# EAGLE board E8-F (EAGLE 6.6.0), part 1 of 2
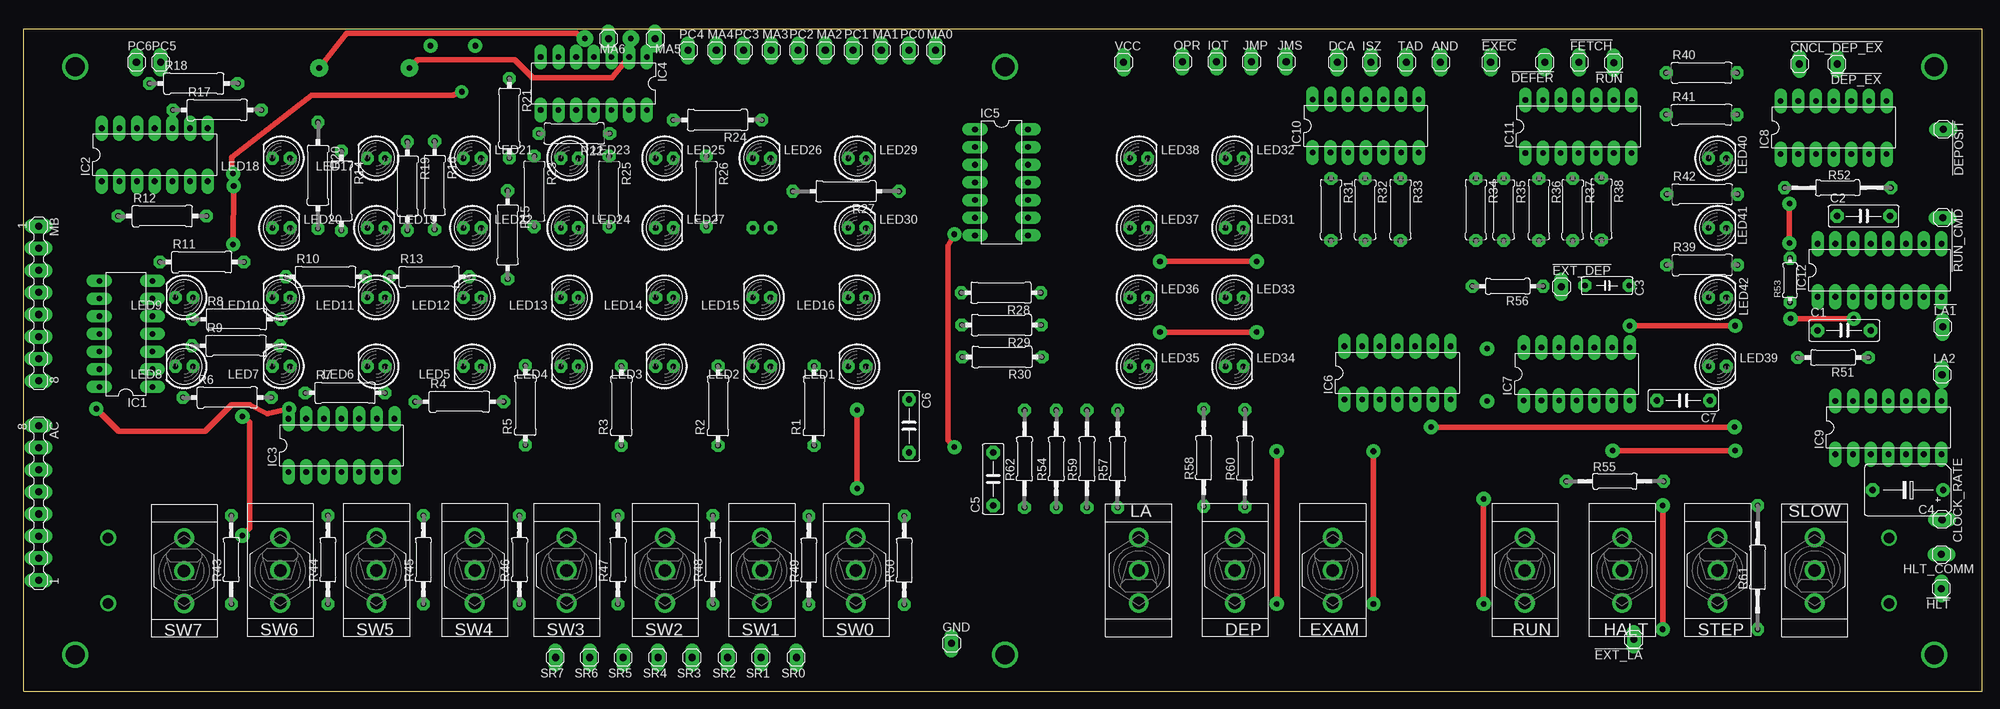
[diagram p2: board, top side]
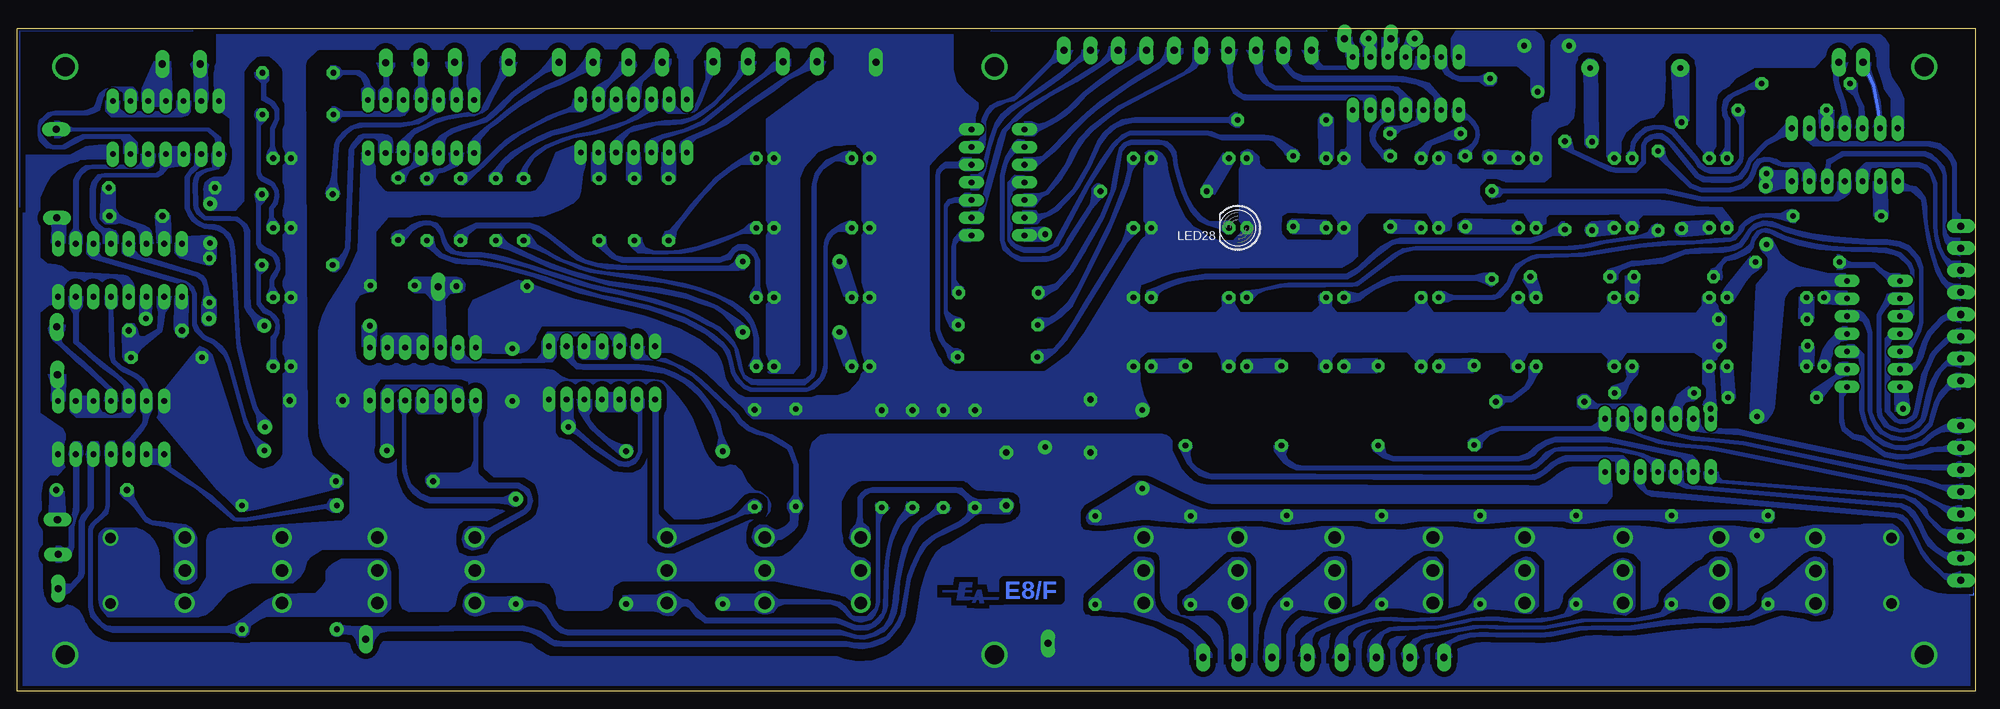
[diagram p3: board, bottom side, seen from below]

Size 281.35 x 95.17 mm. Coordinates in mm from the lower left corner, seen from the top.
Outline: 0,0 281.35,0 281.35,95.17 0,95.17 0,0
Copper layers (1*16): Top 0.035mm / dielectric 1.5mm / Bottom 0.035mm
Design rules "default *": minimum track width 3mil, minimum drill 32mil, track to track 8mil, track to pad 8mil, pad to pad 8mil, via to via 8mil, smd to smd 8mil, copper to edge 10mil, drill to drill 8mil, minimum pad ring 20mil, minimum via ring 8mil, stop-mask expansion 4mil, vias tented up to drill 0mil, thermal gap 10mil

## Footprints (pad centres in the part's own frame; a part is rotated, then mirrored left to right if it is on the bottom)
MA01-1 = drill 1.016 long: 1 0,0
MA08-1 = drill 1.016 long: 1 -12.7,0; 2 -9.525,0; 3 -6.35,0; 4 -3.175,0; 5 0,0; 6 3.175,0; 7 6.35,0; 8 9.525,0
C075-032X103 = drill 0.914 octagon: 1 -3.81,0; 2 3.81,0
C063-025X075 = drill 0.813 octagon: 1 -2.54,0; 2 3.81,0
B45181C = drill 0.914: + -5.08,0 | drill 0.914 octagon: - 5.08,0
7109 = drill 1.803: 1 0,4.699; 2 0,0; 3 0,-4.699
DIL14 = drill 0.813 long: 1 -7.62,-3.81; 2 -5.08,-3.81; 3 -2.54,-3.81; 4 0,-3.81; 5 2.54,-3.81; 6 5.08,-3.81; 7 7.62,-3.81; 8 7.62,3.81; 9 5.08,3.81; 10 2.54,3.81; 11 0,3.81; 12 -2.54,3.81; 13 -5.08,3.81; 14 -7.62,3.81
DIL16 = drill 0.813 long: 1 -8.89,-3.81; 2 -6.35,-3.81; 3 -3.81,-3.81; 4 -1.27,-3.81; 5 1.27,-3.81; 6 3.81,-3.81; 7 6.35,-3.81; 8 8.89,-3.81; 9 8.89,3.81; 10 6.35,3.81; 11 3.81,3.81; 12 1.27,3.81; 13 -1.27,3.81; 14 -3.81,3.81; 15 -6.35,3.81; 16 -8.89,3.81
LED5MM = drill 0.813 octagon: A -1.27,0; K 1.27,0
0309/.45 = drill 0.813 octagon: 1 -5.715,0; 2 5.715,0
0309/12 = drill 0.813 octagon: 1 -6.35,0; 2 6.35,0
0309/11 = drill 0.813 octagon: 1 -6.032,0; 2 6.032,0
0309/15 = drill 0.813 octagon: 1 -7.62,0; 2 7.62,0
0309/10 = drill 0.813 octagon: 1 -5.08,0; 2 5.08,0
0309/8 = drill 0.813 octagon: 1 -4.445,0; 2 4.445,0
0207/12 = drill 0.813 octagon: 1 -6.35,0; 2 6.35,0
0207/10 = drill 0.813 octagon: 1 -5.08,0; 2 5.08,0
0207/15 = drill 0.813 octagon: 1 -7.62,0; 2 7.62,0
0204/6 = drill 0.813 octagon: 1 -3.175,0; 2 3.175,0
0207/13 = drill 0.813 octagon: 1 -6.985,0; 2 6.985,0
0207/22 = drill 0.813 octagon: 1 -8.89,0; 2 8.89,0

## Placement (x,y rotation side)
!CNCL_DEP_EX  MA01-1  [MA01-1]  255.1,90.09 0 top
!DEFER  MA01-1  [MA01-1]  218.52,90.34 180 top
!DEP_EX  MA01-1  [MA01-1]  260.52,90.09 180 top
!DEPOSIT  MA01-1  [MA01-1]  275.76,80.69 270 top
!EXEC  MA01-1  [MA01-1]  210.74,90.34 0 top
!EXT_DEP  MA01-1  [MA01-1]  220.9,58.08 0 top
!EXT_LA  MA01-1  [MA01-1]  231.31,7.45 180 top
!FETCH  MA01-1  [MA01-1]  223.44,90.34 0 top
!HLT  MA01-1  [MA01-1]  275.51,14.73 180 top
!LA1  MA01-1  [MA01-1]  275.67,52.32 0 top
!RUN  MA01-1  [MA01-1]  228.43,90.25 180 top
!RUN_CMD  MA01-1  [MA01-1]  275.67,67.99 270 top
AC  AC  [MA08-1]  2.12,28.62 90 top
AND  MA01-1  [MA01-1]  203.54,90.34 0 top
C1  100pF  [C075-032X103]  261.54,51.82 0 top
C2  1nF  [C075-032X103]  264.33,68.24 0 top
C3  0.1uF  [C063-025X075]  226.82,58.25 0 top
C4  47uF  [B45181C]  270.68,28.87 180 top
C5  0.1uF  [C075-032X103]  139.28,30.48 90 top
C6  0.1uF  [C075-032X103]  127.17,38.1 270 top
C7  0.047uF  [C075-032X103]  238.42,41.74 180 top
CLOCK_RATE  MA01-1  [MA01-1]  275.59,24.64 270 top
DCA  MA01-1  [MA01-1]  188.72,90.34 0 top
DEP  710X  [7109]  173.99,17.36 180 top
EXAM  710X  [7109]  188.04,17.36 180 top
GND  MA01-1  [MA01-1]  133.27,6.86 0 top
HALT  710X  [7109]  229.62,17.36 180 top
HLT_COMM  MA01-1  [MA01-1]  275.51,19.64 90 top
IC1  7405N  [DIL14]  14.65,51.31 90 top
IC2  7405N  [DIL14]  18.8,77.05 0 top
IC3  7405N  [DIL14]  45.64,35.31 0 top
IC4  7405N  [DIL14]  81.87,87.29 180 top
IC5  7405N  [DIL14]  140.46,73.07 270 top
IC6  7400N  [DIL14]  197.36,45.72 0 top
IC7  7400N  [DIL14]  223.1,45.55 0 top
IC8  7400N  [DIL14]  260.01,80.94 0 top
IC9  7400N  [DIL14]  267.89,37.85 0 top
IC10  7417N  [DIL14]  192.79,81.2 0 top
IC11  7417N  [DIL14]  223.35,81.11 0 top
IC12  DM9602N  [DIL16]  266.62,60.45 0 top
IOT  MA01-1  [MA01-1]  171.37,90.42 0 top
ISZ  MA01-1  [MA01-1]  193.55,90.34 0 top
JMP  MA01-1  [MA01-1]  176.36,90.42 0 top
JMS  MA01-1  [MA01-1]  181.36,90.42 0 top
LA  710X  [7109]  160.19,17.36 0 top
LA2  MA01-1  [MA01-1]  275.59,45.47 0 top
LED1  [LED5MM]  119.72,46.65 180 top
LED2  [LED5MM]  106,46.65 180 top
LED3  [LED5MM]  92.03,46.65 180 top
LED4  [LED5MM]  78.4,46.65 180 top
LED5  [LED5MM]  64.43,46.65 180 top
LED6  [LED5MM]  50.63,46.65 180 top
LED7  [LED5MM]  37,46.65 180 top
LED8  [LED5MM]  23.03,46.65 180 top
LED9  [LED5MM]  23.03,56.56 180 top
LED10  [LED5MM]  37,56.56 180 top
LED11  [LED5MM]  50.63,56.56 180 top
LED12  [LED5MM]  64.43,56.56 180 top
LED13  [LED5MM]  78.4,56.56 180 top
LED14  [LED5MM]  92.03,56.56 180 top
LED15  [LED5MM]  106,56.56 180 top
LED16  [LED5MM]  119.72,56.56 180 top
LED17  [LED5MM]  50.63,76.54 180 top
LED18  [LED5MM]  37,76.54 180 top
LED19  [LED5MM]  50.63,66.55 0 top
LED20  [LED5MM]  37,66.55 0 top
LED21  [LED5MM]  64.43,76.54 0 top
LED22  [LED5MM]  64.43,66.55 0 top
LED23  [LED5MM]  78.4,76.54 0 top
LED24  [LED5MM]  78.4,66.55 0 top
LED25  [LED5MM]  92.03,76.54 0 top
LED26  [LED5MM]  106,76.54 0 top
LED27  [LED5MM]  92.03,66.55 0 top
LED28  [LED5MM]  106,66.55 180 bottom
LED29  [LED5MM]  119.72,76.54 0 top
LED30  [LED5MM]  119.72,66.55 0 top
LED31  [LED5MM]  173.91,66.55 0 top
LED32  [LED5MM]  173.91,76.54 0 top
LED33  [LED5MM]  173.91,56.56 0 top
LED34  [LED5MM]  173.91,46.65 0 top
LED35  [LED5MM]  160.19,46.65 0 top
LED36  [LED5MM]  160.19,56.56 0 top
LED37  [LED5MM]  160.19,66.55 0 top
LED38  [LED5MM]  160.19,76.54 0 top
LED39  [LED5MM]  243.33,46.65 0 top
LED40  [LED5MM]  243.33,76.54 0 top
LED41  [LED5MM]  243.33,66.55 0 top
LED42  [LED5MM]  243.33,56.56 0 top
MA0  MA01-1  [MA01-1]  130.98,92.03 0 top
MA1  MA01-1  [MA01-1]  123.19,92.03 0 top
MA2  MA01-1  [MA01-1]  115.15,92.03 0 top
MA3  MA01-1  [MA01-1]  107.36,92.03 0 top
MA4  MA01-1  [MA01-1]  99.48,92.03 0 top
MA5  MA01-1  [MA01-1]  90.68,93.73 0 top
MA6  MA01-1  [MA01-1]  83.99,93.73 0 top
MB  MB  [MA08-1]  2.12,54.1 270 top
OPR  MA01-1  [MA01-1]  166.45,90.42 0 top
PC0  MA01-1  [MA01-1]  127.17,92.03 0 top
PC1  MA01-1  [MA01-1]  119.13,92.03 0 top
PC2  MA01-1  [MA01-1]  111.25,92.03 0 top
PC3  MA01-1  [MA01-1]  103.38,92.03 0 top
PC4  MA01-1  [MA01-1]  95.42,92.03 0 top
PC5  MA01-1  [MA01-1]  19.64,90.34 0 top
PC6  MA01-1  [MA01-1]  16.17,90.34 0 top
R1  180 1/2W  [0309/.45]  113.54,40.98 90 top
R2  180 1/2W  [0309/.45]  99.74,40.98 90 top
R3  180 1/2W  [0309/.45]  85.85,40.98 90 top
R4  180 1/2W  [0309/12]  62.57,41.57 0 top
R5  180 1/2W  [0309/.45]  72.05,41.06 90 top
R6  180 1/2W  [0309/12]  29.21,42.16 0 top
R7  180 1/2W  [0309/.45]  46.14,42.84 0 top
R8  180 1/2W  [0309/12]  30.56,53.42 0 top
R9  180 1/2W  [0309/12]  30.48,49.61 0 top
R10  180 1/2W  [0309/.45]  43.35,59.52 0 top
R11  180 1/2W  [0309/11]  25.57,61.64 0 top
R12  180 1/2W  [0309/12]  19.9,68.24 0 top
R13  180 1/2W  [0309/.45]  58.25,59.52 0 top
R14  180 1/2W  [0309/.45]  45.64,71.88 270 top
R15  180 1/2W  [0309/12]  69.51,65.53 270 top
R16  180 1/2W  [0309/12]  59.01,72.64 270 top
R17  180 1/2W  [0309/12]  27.77,83.48 0 top
R18  180 1/2W  [0309/12]  24.38,87.29 0 top
R19  180 1/2W  [0309/12]  55.12,72.56 270 top
R20  180 1/2W  [0309/15]  42.25,74.08 270 top
R21  180 1/2W  [0309/.45]  69.77,82.3 270 top
R22  180 1/2W  [0309/10]  79.08,80.09 180 top
R23  180 1/2W  [0309/10]  73.32,71.8 270 top
R24  180 1/2W  [0309/12]  99.65,82.04 180 top
R25  180 1/2W  [0309/10]  84.07,71.8 270 top
R26  180 1/2W  [0309/10]  98.04,71.8 270 top
R27  180 1/2W  [0309/15]  118.11,71.8 180 top
R28  180 1/2W  [0309/.45]  140.38,57.23 180 top
R29  180 1/2W  [0309/.45]  140.46,52.58 180 top
R30  180 1/2W  [0309/.45]  140.55,48.01 180 top
R31  180 1/2W  [0309/8]  187.79,69.17 270 top
R32  180 1/2W  [0309/8]  192.7,69.17 270 top
R33  180 1/2W  [0309/8]  197.78,69.17 270 top
R34  180 1/2W  [0309/8]  208.62,69.17 270 top
R35  180 1/2W  [0309/8]  212.6,69.17 270 top
R36  180 1/2W  [0309/8]  217.68,69.17 270 top
R37  180 1/2W  [0309/8]  222.5,69.17 270 top
R38  180 1/2W  [0309/8]  226.65,69.26 270 top
R39  180 1/2W  [0309/10]  241.13,61.21 0 top
R40  180 1/2W  [0309/10]  241.05,88.82 0 top
R41  180 1/2W  [0309/10]  241.05,82.8 0 top
R42  180 1/2W  [0309/10]  241.13,71.37 0 top
R43  10K  [0207/12]  29.8,18.88 90 top
R44  10K  [0207/12]  43.69,18.88 90 top
R45  10K  [0207/12]  57.4,18.88 90 top
R46  10K  [0207/12]  71.2,18.88 90 top
R47  10K  [0207/12]  85.34,18.88 90 top
R48  10K  [0207/12]  98.98,18.88 90 top
R49  10K  [0207/12]  112.78,18.8 90 top
R50  10K  [0207/12]  126.49,18.8 90 top
R51  10K  [0207/10]  259.93,47.92 180 top
R52  10K  [0207/15]  260.6,72.31 180 top
R53  1K  [0204/6]  253.75,59.01 90 top
R54  10K  [0207/13]  148.34,33.36 90 top
R55  10K  [0207/13]  228.6,30.14 0 top
R56  22K  [0207/10]  213.19,58.17 180 top
R57  10K  [0207/13]  157.14,33.36 90 top
R58  10K  [0207/13]  169.5,33.53 90 top
R59  10K  [0207/13]  152.74,33.36 90 top
R60  10K  [0207/13]  175.43,33.44 90 top
R61  10K  [0207/22]  249.09,17.78 90 top
R62  22K  [0207/13]  143.76,33.36 90 top
RUN  710X  [7109]  215.65,17.36 180 top
SLOW  710X  [7109]  257.3,17.36 0 top
SR0  MA01-1  [MA01-1]  111,4.83 180 top
SR1  MA01-1  [MA01-1]  105.92,4.83 180 top
SR2  MA01-1  [MA01-1]  101.09,4.83 180 top
SR3  MA01-1  [MA01-1]  96.01,4.83 180 top
SR4  MA01-1  [MA01-1]  91.1,4.83 180 top
SR5  MA01-1  [MA01-1]  86.11,4.83 180 top
SR6  MA01-1  [MA01-1]  81.28,4.83 180 top
SR7  MA01-1  [MA01-1]  76.37,4.83 180 top
STEP  710X  [7109]  243.33,17.36 180 top
SW0  710X  [7109]  119.55,17.36 180 top
SW1  710X  [7109]  106,17.36 180 top
SW2  710X  [7109]  92.12,17.36 180 top
SW3  710X  [7109]  77.98,17.36 180 top
SW4  710X  [7109]  64.77,17.36 180 top
SW5  710X  [7109]  50.63,17.36 180 top
SW6  710X  [7109]  36.83,17.36 180 top
SW7  710X  [7109]  23.03,17.27 180 top
TAD  MA01-1  [MA01-1]  198.63,90.34 0 top
VCC  MA01-1  [MA01-1]  157.99,90.34 0 top

## Tracks (layer width: path | path; a pad name or v marks a point on that pad's centre or on a via)
!CNCL_DEP_EX
  pour Bottom (no thermals): 255.95,84.67 255.95,88.73 256.12,89.24 256.46,89.92 256.46,90.09 255.19,91.36 253.83,90 254.08,89.32 253.92,85.09 254.08,84.5
!DEFER
  pour Bottom (no thermals): 219.88,90.34 219.79,89.75 219.2,88.98 218.78,88.31 218.78,86.78 219.29,86.19 219.29,84.92 217.25,84.92 217.51,86.19 218.02,86.78 218.02,88.31 217.42,89.58 217.34,90.17 217.34,90.34
!DEP_EX
  pour Bottom (no thermals): 259.42,84.07 260.1,83.9 262.64,83.9 263.23,84.16 263.48,84.84 263.48,85.77 263.4,86.61 261.7,90.51 259.33,90.51 259.08,84.92
!DEPOSIT  (via drill 0.81 pad 2.03)
  Top 0.813: v230.72,52.49 v245.87,52.49
  pour Bottom (no thermals): 231.82,49.45 231.82,52.58 229.7,52.58 229.79,49.45
  pour Bottom (no thermals): 246.13,51.48 246.8,51.82 247.23,52.49 247.65,53.51 248.24,54.36 248.67,55.12 248.67,65.87 248.84,66.55 249.34,67.14 250.11,67.56 253.24,67.56 254.42,67.65 255.61,68.58 255.95,69.26 256.03,70.1 256.12,72.9 255.95,73.74 255.52,74.51 254.93,74.85 254.17,75.1 253.32,75.27 253.41,77.22 252.81,78.4 252.9,79.42 254,80.43 273.39,80.43 274.15,80.18 275.34,79.42 276.01,79.42 276.01,81.96 275.42,81.96 274.57,81.45 273.22,80.94 253.83,80.94 252.14,79.59 252.14,78.4 251.38,77.22 251.54,76.2 252.48,74.93 253.92,74.59 254.68,74.34 255.27,73.83 255.52,72.81 255.44,69.68 255.19,69 254.34,68.24 250.7,68.24 249.77,68.16 249.09,67.65 248.41,67.06 247.99,66.21 247.99,56.64 247.82,55.03 247.06,54.19 246.38,53.76 245.53,53.51 245.03,53.09
!EXEC
  pour Bottom (no thermals): 209.55,90.34 209.97,89.32 210.65,88.9 211.75,87.55 212.09,86.95 213.11,85.01 213.78,83.57 214.55,82.97 215.65,82.55 217.42,82.47 219.54,82.04 221.23,81.53 223.44,80.43 224.45,79.84 224.96,79.08 224.87,77.3 226.91,77.3 226.74,78.66 226.23,79.16 225.38,79.93 224.28,80.86 222.76,81.45 221.32,82.21 219.37,82.72 216.83,83.14 215.39,83.31 214.55,83.82 214.12,84.58 213.36,86.11 212.34,87.97 211.92,89.49 212.09,90.34 211.92,91.19
!EXT_DEP
  pour Bottom (no thermals): 219.96,49.19 219.63,49.45 219.88,56.3 219.2,57.07 217.51,57.32 217,57.57 216.92,58.42 217.51,59.27 218.19,59.44 224.37,59.44 224.96,58.76 224.96,57.74 224.37,57.23 222.67,57.15 221.66,56.05 221.66,49.45
!EXT_LA  (via drill 0.81 pad 2.03)
  Top 0.813: v235.46,8.89 v235.46,26.67
  pour Bottom (no thermals): 138.18,26.92 138.43,27.35 139.02,27.69 143.26,27.52 144.19,27.86 145.03,28.53 145.63,29.13 146.39,29.21 158.58,29.21 159.6,28.96 160.19,28.36 160.61,27.77 160.61,25.15 160.95,23.88 161.63,23.11 161.88,22.01 158.75,21.84 158.75,22.78 159,23.45 159.85,24.21 159.94,25.4 159.94,27.6 159.43,28.19 158.75,28.53 146.39,28.53 145.63,28.11 144.86,27.26 144.86,25.74 145.2,25.06 146.05,24.3 148.25,23.28 150.03,22.27 151.21,21.25 151.72,20.49 152.4,19.3 152.99,17.86 153.5,16.51 153.67,15.58 154.09,13.21 154.43,11.09 155.02,9.82 155.7,8.81 156.55,7.79 157.82,7.28 159.09,6.86 160.95,6.86 162.14,7.11 203.03,7.11 204.3,7.28 205.32,8.04 206.25,8.64 207.43,9.06 208.79,9.4 232.66,9.23 234.27,9.4 234.7,9.48 234.95,9.91 236.22,8.13 235.8,7.87 235.12,7.87 234.61,8.21 233.26,8.13 232.75,7.54 232.66,6.94 232.33,6.27 231.56,6.1 230.89,6.1 230.21,6.69 229.95,7.54 229.19,8.38 228.26,8.64 209.04,8.72 207.86,8.55 206.84,8.13 205.74,7.45 204.98,6.86 204.22,6.52 203.03,6.43 162.22,6.43 161.21,6.27 159.94,6.1 158.41,6.35 156.97,6.86 156.04,7.54 154.43,9.48 153.84,10.84 153.5,12.53 152.99,15.92 152.48,17.53 151.55,19.56 150.71,20.83 149.44,21.93 145.88,23.71 144.7,24.38 143.76,25.23 143,25.57 139.53,25.4 138.77,25.48 138.35,25.99 138.18,26.67
  pour Bottom (no thermals): 158.75,21.84 159.26,21.08 160.19,20.66 161.21,21 161.88,22.01
  pour Bottom (no thermals): 259.33,32.17 257.22,30.73 255.27,29.38 253.41,28.11 251.54,26.33 250.11,24.98 249.34,24.89 248.33,24.98 236.81,26.92 236.39,27.6 235.71,27.69 235.12,27.69 235.12,25.57 236.05,25.65 236.98,26.16 248.24,24.38 249.68,24.3 250.27,24.47 253.24,27.01 255.69,29.04 256.88,29.8 258.66,30.9 260.35,32.09 261.37,32.51 263.31,32.51 263.57,32.77 263.57,34.29 263.23,34.8 259.67,34.8 259.42,34.29 259.42,32.85
!FETCH
  pour Bottom (no thermals): 224.37,84.92 224.28,86.36 223.69,86.95 223.69,88.39 224.11,89.07 224.71,89.92 224.71,90.34 222.17,90.34 222.17,89.92 222.5,89.24 222.93,88.48 222.93,86.95 222.5,86.28 222.33,84.92
!HLT
  pour Bottom (no thermals): 275.51,13.46 275.51,16 275.34,16 274.83,15.75 274.57,15.41 273.64,15.41 273.22,15.83 272.63,16.51 272.46,17.27 272.46,24.38 272.12,25.23 271.53,25.82 271.19,26.5 271.19,32.51 271.44,34.04 271.19,35.31 270.76,35.9 269.83,35.9 269.58,35.31 269.49,33.78 270.43,32.51 270.43,26.33 270.59,25.99 271.27,25.15 271.78,24.3 271.78,16.93 271.95,16.26 273.98,14.05 274.74,13.63
!LA1
  pour Bottom (no thermals): 268.9,41.66 268.73,42.42 268.14,43.1 271.7,46.31 272.88,47.33 275.08,49.36 276.1,50.29 276.69,51.31 276.94,52.15 276.52,52.75 274.49,52.66 274.57,51.82 275.17,50.97 275,50.12 273.81,49.02 271.78,47.33 267.38,43.18 267.04,42.33 266.87,41.66
!RUN
  pour Bottom (no thermals): 229.45,84.92 229.45,86.28 228.68,87.21 228.68,88.31 229.28,89.15 229.53,89.75 229.7,90.25 227.16,90.25 227.16,89.66 227.58,89.15 228.01,88.22 228.01,87.04 227.41,86.28 227.41,84.92
!RUN_CMD
  pour Bottom (no thermals): 276.52,64.35 276.35,66.46 276.52,67.14 276.94,67.65 274.66,68.75 274.4,67.99 274.4,66.38 274.49,64.35
AC0
  pour Bottom (no thermals): 2.12,14.82 2.12,17.19 2.71,17.02 3.56,16.76 4.57,16.93 6.35,18.63 7.54,20.15 8.38,22.01 9.65,24.55 10.5,25.23 11.6,25.57 46.31,28.7 47.16,28.87 47.58,29.63 47.33,30.73 47.33,31.58 49.19,31.67 49.19,30.4 48.51,29.46 47.41,28.36 46.57,28.02 11.26,24.89 10.41,24.3 9.74,23.45 8.04,19.98 7.2,18.71 4.4,16.09 3.64,15.75 2.79,14.9
AC1
  pour Bottom (no thermals): 2.46,18.03 3.47,18.54 4.66,19.22 5.76,19.98 6.77,20.83 7.54,22.01 8.04,23.28 8.97,24.81 9.82,25.74 10.84,26.33 41.66,29.04 42.76,29.55 43.69,30.23 44.11,30.73 44.11,31.75 42.08,31.75 42.08,30.73 41.91,29.97 41.15,29.63 10.58,27.01 9.57,26.5 8.72,25.74 8.04,24.64 6.94,22.35 5.67,20.83 4.66,20.07 3.64,19.9 2.79,20.24 2.03,20.32 2.03,18.03
AC2
  pour Bottom (no thermals): 2.88,21.25 5.16,22.86 7.11,24.89 7.87,25.99 8.72,26.84 10.08,27.6 38.44,29.97 38.95,30.56 39.03,31.5 37,31.5 36.91,30.82 36.49,30.4 10.41,28.28 8.72,27.69 7.11,26.16 6.77,25.23 4.91,23.45 4.06,23.28 3.13,23.28 2.62,23.62 1.95,23.54 1.95,21.08
AC3
  pour Bottom (no thermals): 2.29,24.3 2.88,24.55 5.25,26.42 8.3,28.11 10.16,28.96 36.91,34.37 39.2,34.71 42.59,35.05 45.55,35.56 47.58,36.24 49.11,36.91 50.29,37.17 51.14,37.42 51.65,38.02 51.65,39.37 49.78,39.37 49.78,38.69 49.53,37.85 48.01,36.91 44.87,35.98 41.83,35.56 38.44,35.22 34.97,34.63 9.91,29.55 8.04,28.7 6.69,27.86 4.66,26.84 3.47,26.5 2.62,26.67 2.03,26.67 2.03,24.3
AC4
  pour Bottom (no thermals): 2.03,27.43 2.46,27.52 4.32,28.7 7.11,29.72 33.36,35.31 37.42,35.73 40.56,35.98 43.43,36.66 45.04,37.25 46.14,38.02 46.48,38.44 46.48,39.45 44.87,39.45 44.87,38.86 44.37,37.93 43.6,37.25 41.06,36.66 33.27,35.9 7.2,30.48 4.83,29.63 3.3,29.63 1.86,29.89 1.95,27.43
AC5
  pour Bottom (no thermals): 2.03,30.65 2.03,33.02 2.54,32.94 3.13,32.51 5.84,32.43 9.91,32.51 11.85,32.85 32.6,37.25 34.12,37.59 38.78,37.76 39.29,37.93 39.54,38.52 39.54,39.12 41.57,39.12 41.49,38.27 40.89,37.51 39.2,37.17 35.98,37 33.87,36.83 10.58,31.92 4.15,31.75 3.47,31.16 2.62,30.73 2.2,30.56
AC6
  pour Bottom (no thermals): 2.03,33.7 2.03,36.24 2.62,36.15 3.47,35.48 4.66,35.14 6.52,34.97 8.21,34.37 9.82,33.95 11.43,34.04 12.95,34.29 14.48,35.39 16.09,36.58 17.53,36.91 18.71,37.93 18.97,39.29 18.97,42.33 18.37,43.01 18.37,44.62 19.22,44.53 19.56,44.03 19.56,38.61 19.22,37.51 17.7,36.24 16.26,35.9 14.05,34.29 13.12,33.7 11.26,33.27 9.14,33.44 7.54,33.87 6.01,34.37 4.49,34.46 3.56,34.37 2.88,33.87
AC7
  pour Bottom (no thermals): 2.03,37 2.03,39.37 2.62,39.29 3.3,38.78 5.08,37.93 6.1,37.34 6.94,36.66 7.7,35.98 9.99,35.22 11.68,35.31 12.95,35.81 14.48,36.83 15.49,38.27 16,40.22 16,48.34 17.44,49.78 18.54,49.78 18.54,47.92 16.76,47.92 16.68,46.74 16.68,40.3 16.34,38.95 15.83,37.68 14.73,36.24 13.29,35.22 11.6,34.71 9.91,34.63 8.21,35.22 7.54,35.31 5.93,36.66 4.91,37.17 3.89,37.34 2.46,36.91
AND
  pour Bottom (no thermals): 204.55,91.19 205.06,90.51 205.49,90 206.5,88.82 208.7,87.21 210.4,85.85 212.34,83.99 214.04,82.47 215.39,81.87 217.34,81.36 218.95,80.77 220.64,79.76 221.66,78.57 221.83,77.64 221.83,77.05 219.88,77.05 219.88,78.99 219.54,79.67 218.69,80.18 217.09,80.77 215.22,81.36 213.87,81.79 213.02,82.47 211.58,83.74 209.97,85.43 208.53,86.53 207.01,87.71 205.57,88.73 204.55,89.15 203.45,89.15 202.61,89.58 202.61,90.76
CLOCK_RATE
  pour Bottom (no thermals): 274.32,24.72 274.57,28.62 276.78,28.87 276.86,24.72
DCA
  pour Bottom (no thermals): 187.45,90.85 187.45,90.09 187.71,89.58 188.47,89.07 189.31,88.98 190.5,88.39 191.52,87.55 191.77,86.78 191.77,86.11 191.85,85.01 193.89,85.01 193.63,86.19 193.12,87.12 191.43,88.56 190.33,89.66 189.82,90.93
G$1030
  pour Bottom (no thermals): 145.88,13.46 140.38,13.46 140.46,13.12 145.88,13.12
  pour Bottom (no thermals): 142.83,14.48 143.43,14.48 143.09,12.7 142.49,12.7
  pour Bottom (no thermals): 143.43,14.48 143.09,14.48 143.76,12.7 144.1,12.7
  pour Bottom (no thermals): 144.53,13.12 144.44,13.46 145.37,13.46 145.12,14.99 144.19,14.99 144.1,15.58 145.97,15.58 146.39,13.12
  pour Bottom (no thermals): 148.34,14.22 148.34,14.48 144.27,14.48 144.27,14.22
G$1123
  pour Bottom (no thermals): 93.13,95.08 141.56,95.08 141.56,94.83 93.13,94.83
G$1126
  pour Bottom (no thermals): 281.01,94.83 256.12,94.83 256.12,95.08 281.01,95.08
  pour Bottom (no thermals): 281.26,69.51 281.26,95.08 281.01,95.08 281.01,69.51
GND  (via drill 0.81 pad 1.86, 0.81 pad 2.03, 1.52 pad 2.03, 2.71 pad 3.56)
  Top 0.813: v30.14,72.56 v30.06,64.18 | v31.41,39.45 32.43,38.61 32.43,23.37 v31.41,22.35 | v30.06,74.34 29.89,74.17 29.89,76.71 41.32,85.6 61.64,85.6 v62.91,86.11 | v133.69,35.05 132.76,36.07 132.76,64.01 v133.69,65.62
  Bottom 0.085: 0.34,14.05 0.34,13.8 0.85,13.8
  other vias: 267.97,12.62 267.97,22.01 12.11,12.62 12.11,22.01 274.49,5.25 7.37,5.25 140.97,5.25 210.23,41.66 64.85,92.71
  pour Bottom (no thermals): 25.4,73.15 25.48,74.34 25.99,74.76 28.96,74.76 29.63,75.35 30.48,75.35 31.07,74.76 31.07,71.97 30.31,71.46 29.46,71.63 27.86,72.22 26.16,72.22 25.4,72.9
  pour Bottom (no thermals): 18.63,59.94 21.08,59.94 25.23,60.96 27.01,61.81 28.02,62.65 28.79,64.18 29.13,64.94 29.72,65.11 30.23,65.11 30.82,64.94 31.07,64.35 30.99,63.67 30.56,63.08 30.23,62.74 29.89,62.23 29.89,60.37 31.58,58.34 32.51,39.29 32.09,38.69 31.33,38.52 30.65,38.52 30.06,38.78 29.13,39.96 28.87,40.72 27.43,56.47 26.84,57.4 25.91,58.08 24.3,58.25 18.46,58.25
  pour Bottom (isolate 0.762, rank 2, no thermals): 364 corners
  pour Bottom (no thermals): 0.08,95.08 12.53,95.08 12.53,94.83 0.34,94.83 0.34,13.8 0.08,13.8
  pour Bottom (isolate 0.762, rank 2, no thermals): 21.17,10.24 22.27,9.91 28.7,9.91 30.48,9.4 73.07,4.83 73.58,4.57 74.34,4.06 75.18,3.13 76.12,2.71 111.08,2.71 112.01,2.79 112.86,3.22 113.28,3.98 113.79,5.42 114.55,6.43 115.65,7.79 117.09,8.47 118.62,9.14 120.06,9.57 122.34,10.08 124.21,10.5 127.08,10.5 128.19,11.51 128.52,11.94 128.52,13.46 128.19,13.97 127.08,15.16 125.73,16.26 123.61,18.2 121.92,19.56 120.57,20.49 118.96,20.74 116.25,21 113.79,21.25 109.22,21.25 107.95,21 106.17,20.66 104.73,20.66 102.79,21 100.08,21.17 95.17,21.17 94.06,20.91 92.2,20.74 90.68,20.74 88.73,21 85.68,21.25 82.13,21.34 80.6,21.08 78.91,20.83 76.96,20.83 74.59,21.08 72.64,21.25 70.1,21.25 68.24,21.08 66.72,20.91 65.02,20.74 62.91,20.74 61.13,21.08 58.5,21.25 55.46,21.25 53.34,21.17 51.22,20.74 49.87,20.74 47.84,21.08 45.55,21.17 43.18,21.34 40.98,21.25 39.29,21.08 37.25,20.74 35.22,20.83 33.53,21.08 27.6,21.34 26.25,21.17 21.59,20.4 20.49,19.22 20.49,11.09
  pour Bottom (isolate 0.762, rank 2, no thermals): 188.64,19.56 190.16,19.9 191.43,21 191.85,21.93 191.85,26.42 192.02,27.43 192.62,28.87 193.63,30.06 202.69,36.07 204.39,37.51 204.39,39.37 204.05,39.88 203.88,40.3 203.88,42.67 203.12,43.43 189.48,43.43 189.06,43.26 188.55,42.76 188.13,41.91 188.13,27.35 187.96,26.67 186.94,25.57 185.67,25.32 180.59,25.65 177.97,26.75 176.36,27.94 175.6,28.28 174.58,27.94 173.99,27.52 173.91,26.5 174.16,25.48 187.45,19.81
  pour Bottom (isolate 0.762, rank 2, no thermals): 188.64,19.56 190.16,19.9 191.43,21 191.85,21.93 191.85,26.42 192.02,27.43 192.62,28.87 193.63,30.06 202.69,36.07 204.39,37.51 204.39,39.37 204.05,39.88 203.88,40.3 203.88,42.67 203.12,43.43 189.48,43.43 189.06,43.26 188.55,42.76 188.13,41.91 188.13,27.35 187.96,26.67 186.94,25.57 185.67,25.32 180.59,25.65 177.97,26.75 176.36,27.94 175.6,28.28 174.58,27.94 173.99,27.52 173.91,26.5 174.16,25.48 187.45,19.81
  pour Bottom (isolate 0.762, rank 2, no thermals): 215.73,19.39 216.66,19.56 221.49,24.21 230.38,34.04 230.38,35.05 229.87,35.64 229.87,43.86 229.11,44.7 228.35,44.96 219.88,44.96 218.1,44.7 216.75,44.03 214.21,44.03 213.53,42.42 213.53,33.95 213.28,32.43 211.58,30.9 210.74,30.56 209.47,30.56 208.2,30.31 207.09,29.21 206.59,28.28 206.59,26.42 206.93,25.4 214.46,19.56
  pour Bottom (isolate 0.762, rank 2, no thermals): 134.54,17.44 144.02,17.44 144.02,11.94 134.54,11.94
  pour Bottom (isolate 0.762, rank 2, no thermals): 215.73,19.39 216.66,19.56 221.49,24.21 230.38,34.04 230.38,35.05 229.87,35.64 229.87,43.86 229.11,44.7 228.35,44.96 219.88,44.96 218.1,44.7 216.75,44.03 214.21,44.03 213.53,42.42 213.53,33.95 213.28,32.43 211.58,30.9 210.74,30.56 209.47,30.56 208.2,30.31 207.09,29.21 206.59,28.28 206.59,26.42 206.93,25.4 214.46,19.56
  pour Bottom (no thermals): 62.06,85.94 62.15,85.34 63.16,85.17 63.58,85.43 63.92,86.19 63.92,88.14 65.87,89.75 72.9,89.75 74.08,89.92 75.1,90.42 75.35,91.19 75.35,93.81 74.51,95.08 63.67,95.08 62.57,94.32 62.06,93.39
  pour Bottom (no thermals): 133.69,66.72 136.74,66.46 136.74,64.52 133.69,64.6
HALT
  pour Bottom (no thermals): 248.67,7.7 248.07,8.21 247.9,8.97 247.73,9.48 246.63,10.24 245.53,10.75 228.77,10.75 227.67,11.94 227.67,17.1 227.92,18.03 228.35,18.63 229.11,18.97 234.87,18.97 235.88,18.37 236.56,17.86 237.07,17.19 237.07,15.75 237.66,14.9 238.51,14.05 243.67,13.89 245.7,12.95 247.9,11.26 248.92,10.5 250.02,9.74 251.38,9.23 267.38,9.23 268.48,9.4 269.16,9.82 269.92,10.75 270.34,11.35 270.51,12.45 270.51,23.2 270.09,23.96 268.99,24.89 268.31,25.57 268.05,26.59 268.05,32.6 266.87,34.04 267.04,35.14 267.29,35.64 267.38,35.9 268.22,35.9 268.82,35.22 268.9,34.04 268.65,32.68 268.65,26.75 268.82,26.08 269.32,25.4 270.76,24.05 271.1,23.62 271.19,23.11 271.19,12.11 270.85,10.75 269.83,9.65 268.82,8.81 267.72,8.47 251.12,8.47 250.11,8.21 249.51,7.79
HLT_COMM
  pour Bottom (no thermals): 275.76,18.46 275.76,20.91 275.17,20.91 274.83,20.66 274.24,20.57 273.9,20.83 273.9,23.45 273.64,24.81 273.3,25.82 273.22,26.84 273.22,32.26 273.39,32.77 273.98,34.04 273.64,35.31 273.22,35.9 272.46,35.9 272.03,35.31 271.95,34.04 272.54,32.34 272.54,25.91 273.05,24.47 273.22,23.54 273.22,20.66 273.64,19.64 275.08,18.46
IOT
  pour Bottom (no thermals): 170.26,90.85 170.26,89.75 171.11,89.32 172.47,89.07 173.31,88.65 175.77,86.87 178.31,85.01 180.51,83.14 182.8,81.36 185,80.43 187.2,79.67 188.81,79.25 189.4,78.82 189.31,77.39 191.26,77.39 191.18,78.66 190.16,79.42 188.72,80.01 185.59,80.77 183.05,81.96 181.53,83.06 178.99,85.17 174.07,88.82 173.14,89.92 172.64,90.42
ISZ
  pour Bottom (no thermals): 194.9,90.34 194.99,89.83 196.34,87.97 198.04,86.95 198.8,86.11 198.88,85.01 196.93,85.01 196.77,86.53 195.92,87.46 194.23,88.82 193.38,89.15 192.79,89.24 192.28,89.83 192.36,90.34
JMP
  pour Bottom (no thermals): 177.72,90.42 177.72,89.41 178.14,88.31 179.49,86.61 181.36,84.58 182.96,83.4 184.66,82.38 186.01,82.04 188.47,81.96 191.09,81.53 192.79,81.11 193.72,80.6 195.16,79.59 196.09,78.66 196.34,77.39 194.39,77.39 194.31,79.16 193.29,80.26 191.77,80.69 189.65,81.28 187.54,81.36 185.76,81.53 183.9,82.13 182.96,82.72 181.19,84.07 179.07,86.28 177.55,88.05 176.87,88.9 176.02,89.24 175.68,89.58 175.18,90.25 175.18,90.42
JMS
  pour Bottom (no thermals): 182.71,90.51 182.63,89.92 182.46,89.15 182.46,87.88 183.81,84.41 184.23,83.74 184.83,83.57 186.27,83.57 186.77,84.07 186.77,85.01 188.72,85.01 188.72,83.74 187.88,82.97 185,82.97 184.07,83.23 183.64,83.57 183.05,84.58 181.78,87.97 180.93,89.07 180.34,89.75 180.34,90.85
LA2
  pour Bottom (no thermals): 276.52,41.66 276.44,43.94 276.69,44.87 276.94,45.55 274.4,45.55 274.49,41.66
MA0
  pour Bottom (no thermals): 129.71,92.03 130.22,91.02 130.98,90.76 132.76,90 137.24,85.51 138.18,84.75 139.28,84.5 140.04,84.16 141.05,83.74 141.82,82.89 142.24,81.79 142.24,79.67 142.32,78.49 142.58,77.72 143.17,77.22 144.44,77.22 144.44,79.16 143.26,79.16 142.83,79.67 142.83,81.62 142.66,82.38 142.16,83.4 141.56,84.16 140.55,84.75 139.28,85.01 137.92,85.6 133.43,90.09 132.67,90.93 132.33,91.69 132.25,92.03
MA1
  pour Bottom (no thermals): 122.09,92.29 122.09,91.52 122.43,91.1 123.02,90.85 123.7,91.02 124.29,90.68 125.39,89.92 127,88.82 129.2,87.46 133.35,85.17 135.38,83.82 136.74,82.89 138.18,81.53 139.28,80.35 139.7,78.99 142.58,68.33 143.17,67.06 144.36,67.06 144.36,69 143.17,69.09 140.38,79.25 139.78,80.6 137.16,83.4 135.64,84.5 133.18,85.85 129.62,87.97 125.73,90.42 124.71,91.52 124.46,92.63
MA2
  pour Bottom (no thermals): 113.88,92.37 113.88,91.61 114.55,91.02 115.32,90.85 116.42,90.25 117.26,89.49 119.21,88.31 121.58,86.87 124.8,84.58 126.24,83.48 127.68,82.3 129.29,80.69 132.25,77.55 133.86,76.28 135.72,74.68 136.74,74.68 136.74,76.71 135.38,76.71 134.03,76.88 132.5,78.32 129.71,81.28 127.68,83.14 125.81,84.75 123.02,86.7 120.73,88.22 118.28,89.66 117.09,90.51 116.5,91.52 116.33,92.46
MA3
  pour Bottom (no thermals): 86.02,83.57 86.02,84.58 86.19,85.34 86.53,85.6 104.31,85.6 105.33,85.77 106.26,86.53 106.68,87.55 106.76,89.41 106.51,90.85 106.17,91.44 106,92.12 108.54,92.12 108.29,91.36 107.95,90.59 107.53,89.32 107.36,87.55 107.02,86.53 106.68,85.94 105.92,85.34 105.16,84.92 88.14,84.92 87.97,84.41 88.05,83.57
MA4
  pour Bottom (no thermals): 75.86,83.57 75.86,84.33 78.49,87.29 80.52,87.88 82.13,88.22 83.06,88.31 96.52,88.31 97.79,88.82 98.64,89.75 98.89,90.68 98.3,91.36 98.21,92.03 100.75,92.03 100.58,91.52 99.99,90.59 99.31,89.58 98.72,88.82 98.04,88.14 96.86,87.63 83.23,87.63 81.79,87.46 80.35,87.21 79.25,86.7 77.89,85.43 77.72,84.24 77.89,83.57
MA5
  pour Bottom (no thermals): 90.51,91.02 90.51,91.86 91.61,92.88 91.86,93.39 91.95,93.9 89.58,93.98 89.58,93.47 89.07,92.29 88.56,91.61 88.56,91.1
MA6
  pour Bottom (no thermals): 85.34,93.9 85.34,91.1 83.57,91.1 83.57,92.29 82.8,93.22 82.8,93.81
MB0
  pour Bottom (no thermals): 2.12,65.79 2.12,68.41 2.62,68.75 2.71,69.09 2.71,75.86 3.39,77.05 4.23,77.89 5.08,78.57 6.43,78.91 22.44,78.91 22.94,79.33 22.94,81.03 24.81,81.03 24.81,79.84 24.3,79.16 23.37,78.32 7.03,78.32 5.5,77.98 4.4,77.3 3.81,76.54 3.39,75.27 3.39,66.97 2.96,66.21
  pour Bottom (no thermals): 24.72,80.94 24.72,79.59 23.28,78.32 6.6,78.32 5.33,78.06 3.98,76.71 3.39,75.78 3.22,66.63 2.54,65.87 2.12,68.41 2.71,68.66 2.79,75.86 3.39,76.96 5.08,78.66 6.43,78.91 22.35,78.91 22.94,79.5 22.94,80.94
MB1
  pour Bottom (no thermals): 2.2,62.48 2.2,65.02 2.96,65.02 3.73,65.19 4.15,65.7 4.15,74.08 4.4,75.27 5.33,76.28 6.27,77.13 7.2,77.47 19.22,77.47 20.4,76.79 21.42,76.28 21.51,75.27 22.18,74.25 22.35,73.24 20.4,73.07 20.4,74.08 20.91,74.85 20.83,75.78 19.9,76.37 18.88,76.88 7.45,76.88 6.43,76.45 5.59,75.86 5.08,75.01 4.74,74.17 4.74,65.53 4.4,64.52 3.73,63.58 2.71,62.65
MB2
  pour Bottom (no thermals): 2.12,59.35 2.12,61.72 2.71,61.72 3.56,61.81 4.32,62.48 4.91,63.67 5.42,65.7 5.5,66.97 5.5,72.98 5.93,74 6.43,74.93 7.03,75.52 8.04,75.86 15.75,75.86 16,75.78 17.19,74.51 17.27,73.24 15.32,73.24 15.16,74.76 14.9,75.18 8.47,75.35 7.45,75.01 6.69,74.42 6.27,73.41 6.1,72.73 6.1,66.63 5.84,64.94 5.5,63.58 4.83,62.23 3.98,61.04 3.47,60.28 2.71,59.52 2.2,59.27
MB3
  pour Bottom (no thermals): 2.12,56.05 2.12,58.5 3.05,58.42 3.89,58.76 4.66,59.52 5.42,61.21 6.18,63.58 6.77,66.63 6.94,68.07 6.94,69.6 7.2,70.78 7.79,71.71 8.55,72.47 9.48,72.56 10.24,72.98 10.24,73.41 12.02,73.41 12.02,72.64 11.6,71.97 9.23,71.8 7.79,70.61 7.45,67.56 7.03,64.77 6.52,62.74 5.76,60.2 4.91,58.76 3.89,57.66 3.05,56.39
MB4
  pour Bottom (no thermals): 2.29,52.92 2.71,53 3.22,53.26 4.06,53.26 4.83,52.92 6.35,51.22 6.94,50.12 7.62,47.92 8.04,47.16 8.72,46.14 9.31,45.89 9.99,45.38 10.84,45.3 11.01,47.16 9.99,47.16 9.74,47.07 9.14,46.99 8.55,47.41 8.04,49.02 7.54,50.38 6.77,51.73 4.91,53.76 3.73,54.53 2.79,55.2 2.12,55.29 2.12,52.83
MB5
  pour Bottom (no thermals): 10.84,38.35 11.51,38.61 12.28,39.37 12.95,40.13 12.95,50.72 11.68,52.15 10.84,52.15 10.84,50.46 12.02,50.46 12.36,49.87 12.36,40.3 11.26,39.12 9.99,39.03 9.06,39.62 8.72,40.47 7.7,45.47 6.94,47.16 6.43,48.43 5.59,49.45 4.57,50.46 3.39,51.56 2.62,52.15 2.12,52.24 2.12,49.78 3.39,50.21 3.81,50.29 5.59,48.51 5.93,48.01 6.94,45.72 8.21,40.05 8.55,39.29 9.14,38.78 9.91,38.44
MB6
  pour Bottom (no thermals): 2.2,46.4 3.05,46.65 4.15,46.65 4.91,45.89 5.5,44.87 6.1,43.43 7.03,39.71 7.37,38.78 8.21,37.85 9.31,37.25 10.84,37.08 12.11,37.42 13.04,37.93 13.97,39.37 14.14,40.13 14.14,54.1 13.04,56.05 12.7,57.07 11.94,57.32 10.84,57.32 10.84,55.71 11.68,55.71 12.36,55.63 13.04,54.78 13.63,53.93 13.63,40.89 13.46,39.62 12.45,38.27 10.84,37.59 9.4,37.85 8.81,38.18 7.79,39.2 7.03,42.76 6.43,44.45 5.67,45.89 4.57,47.07 2.88,48.77 2.12,48.94 2.12,46.57
MB7
  pour Bottom (no thermals): 2.54,43.18 3.13,43.43 3.89,43.18 5.16,41.74 5.5,40.81 5.84,39.54 6.27,38.1 7.45,37 8.64,36.24 10.33,35.9 12.02,36.07 13.63,36.91 14.31,37.68 15.07,39.03 15.41,40.3 15.41,51.31 15.75,52.32 16.17,53 16.85,53.26 18.46,52.92 18.46,54.86 16.68,54.69 16.17,54.36 15.32,53.26 14.9,51.56 14.9,40.05 14.31,38.69 13.38,37.51 12.19,36.83 10.41,36.41 9.48,36.58 7.96,37.25 6.69,38.61 6.43,39.71 5.84,41.57 5.25,42.84 3.98,44.2 3.47,45.04 2.79,45.72 2.2,45.72 2.2,43.26
N$1
  pour Bottom (no thermals): 17.27,80.86 16.68,82.8 16.68,83.82 17.44,85.43 18.63,86.44 17.02,87.38 17.02,86.11 16.68,85.26 16.09,83.99 16,82.72 15.32,80.86
N$2
  pour Bottom (no thermals): 20.4,80.86 22.35,80.86 22.52,83.48 20.4,83.48
N$3
  pour Bottom (no thermals): 49.7,31.5 49.78,32.94 50.63,33.78 59.01,33.78 59.86,33.44 61.13,32.77 62.15,31.75 63.16,31.16 64.18,30.99 110.07,31.24 110.91,31.58 111.84,32.09 112.52,32.77 112.78,33.78 112.78,34.46 112.52,34.97 112.52,35.31 114.64,35.31 113.96,33.95 113.28,32.77 112.44,31.83 111.59,30.99 110.57,30.65 109.9,30.48 63.42,30.4 62.48,30.82 61.55,31.41 60.62,32.26 59.94,32.68 59.18,32.94 58.42,33.1 51.82,33.1 51.73,32.68 51.73,31.5
N$4
  pour Bottom (no thermals): 46.65,31.5 46.57,32.43 46.65,32.6 47.41,33.27 48.51,33.78 50.29,34.21 51.14,34.37 52.32,34.46 60.03,34.46 60.62,34.29 61.3,33.7 62.31,32.77 63.16,32 64.01,31.75 97.62,31.75 98.47,32.09 99.31,32.68 100.08,33.61 100.75,34.46 100.84,35.31 98.72,35.31 99.14,34.04 98.89,33.36 97.71,32.6 96.52,32.34 65.02,32.34 63.92,32.43 62.91,33.1 61.64,34.37 60.54,34.97 59.61,35.14 52.92,35.14 51.31,34.97 50.29,34.8 47.75,34.21 46.65,33.7 46.06,33.53 45.3,33.27 44.62,32.6 44.62,31.5
N$5
  pour Bottom (no thermals): 39.54,31.5 39.71,32.43 39.96,33.19 40.72,33.87 53.09,36.49 60.45,36.49 61.72,36.07 63.08,35.22 64.35,34.21 65.7,33.7 83.65,33.7 84.67,34.12 84.92,35.31 85.43,35.9 86.87,35.39 86.61,34.54 85.77,33.95 85.17,33.53 83.82,33.1 65.53,33.1 64.35,33.36 63.42,33.87 62.74,34.63 61.55,35.39 60.37,35.81 52.83,35.81 42.33,33.61 41.49,32.77 41.57,31.5
N$6
  pour Bottom (no thermals): 41.23,43.77 41.74,43.43 42.93,42.5 43.6,40.89 44.11,40.3 44.11,38.95 42.08,39.12 42.08,40.98 41.66,41.49 41.15,41.66 40.47,41.74 39.88,42.16
N$7
  pour Bottom (no thermals): 34.46,42.16 34.8,46.57 36.75,46.65 36.49,42.16
N$8
  pour Bottom (no thermals): 65.11,59.1 64.18,57.57 64.18,56.64 62.23,56.64 62.57,57.91 63.25,60.2
N$9
  pour Bottom (no thermals): 10.84,53 9.99,53 9.48,53.26 8.81,54.1 8.81,60.45 9.14,61.38 10.75,62.99 11.6,63.25 12.78,63.58 14.14,63.67 17.27,63.67 18.8,63.75 20.83,63.92 23.11,64.26 25.4,64.77 27.35,65.36 28.87,66.04 29.55,66.38 30.14,66.46 30.82,66.38 31.41,66.04 32.17,65.02 32.43,64.18 33.1,63.58 34.29,62.91 35.48,62.48 36.07,62.31 37,61.3 37.42,60.79 38.02,60.62 38.35,60.03 36.49,59.01 36.32,59.44 36.41,60.11 36.49,60.62 36.24,61.3 35.73,61.81 34.54,62.06 33.36,62.57 32.43,63.08 31.83,63.84 31.75,64.69 31.07,65.62 30.56,65.96 29.46,65.79 28.53,65.28 27.43,64.77 25.65,64.09 24.05,63.75 22.52,63.5 20.66,63.33 17.95,63.16 15.66,63.16 14.05,63.08 12.95,62.99 11.68,62.65 11.01,62.4 9.91,61.3 9.4,60.28 9.4,55.54 9.82,54.86 10.84,54.86
N$10
  pour Bottom (no thermals): 32.34,62.48 35.98,58 36.49,57.23 34.88,55.96 34.04,57.23 32.94,58.93 32.17,59.86 31.33,60.45 30.73,60.96
N$11
  pour Bottom (no thermals): 18.46,57.4 21.76,57.57 21.76,55.63 18.46,55.46
N$12
  pour Bottom (no thermals): 25.32,46.65 25.32,49.53 23.2,49.53 23.28,46.65
N$13
  pour Bottom (no thermals): 18.29,47.24 19.22,47.24 19.64,47.16 19.98,46.74 20.07,45.97 20.24,45.38 22.69,43.69 23.28,43.35 23.71,43.01 22.69,41.4 22.01,41.74 21.84,42.33 20.74,43.69 19.3,45.04 18.63,45.3 18.2,45.3
N$14
  pour Bottom (no thermals): 25.4,53.51 25.32,56.64 23.28,56.64 23.28,53.51
N$15
  pour Bottom (no thermals): 18.46,52.32 19.13,52.32 21.17,50.29 22.01,48.94 22.78,46.65 20.74,46.65 20.74,47.84 20.15,49.28 19.39,50.29 18.46,50.38
N$16
  pour Bottom (no thermals): 10.84,59.94 12.28,59.94 13.29,60.45 13.97,61.13 14.48,61.55 17.7,61.55 18.37,61.72 19.05,62.4 19.56,62.65 19.98,62.65 19.98,60.54 19.22,60.62 18.37,60.88 14.56,60.88 12.78,59.18 12.53,58.5 11.94,58.08 10.84,58.08
N$17
  pour Bottom (no thermals): 50.38,59.61 50.38,56.64 48.34,56.64 48.26,59.61
N$18
  pour Bottom (no thermals): 26.25,81.7 27.01,81.79 28.87,79.76 30.23,78.99 32.68,76.45 33.27,75.01 34.12,74 34.97,73.83 38.86,73.83 39.79,74.25 43.26,78.57 44.2,79.5 45.04,80.09 45.89,80.09 46.82,79.84 47.5,79.33 48.01,78.49 48.01,76.03 48.85,75.1 51.48,75.1 52.24,75.27 54.1,76.03 57.66,77.72 58,79.16 58.25,79.67 59.61,78.06 58.59,77.55 52.75,74.76 51.82,74.51 48.77,74.51 47.41,75.86 47.41,78.32 47.07,78.91 46.23,79.42 45.38,79.42 44.62,79.08 44.03,78.49 40.3,73.83 39.2,73.15 38.02,73.07 35.14,73.07 33.61,73.58 32.68,74.85 32.17,76.12 29.89,78.49 28.7,79.08 27.94,79.5 27.09,79.67 25.99,80.01
N$19
  pour Bottom (no thermals): 25.91,67.23 26.33,67.23 27.94,67.73 29.55,68.07 30.48,68.07 31.75,67.73 33.19,66.8 33.44,66.04 34.63,64.77 35.22,64.52 37.93,64.35 41.74,64.09 44.37,64.01 48.18,63.67 56.39,62.4 62.82,62.15 63.67,61.98 64.77,61.47 65.53,60.79 66.12,60.03 66.55,58.84 67.31,57.66 68.33,56.47 69.09,56.22 75.01,56.22 75.78,55.88 76.45,55.8 77.13,55.63 77.13,57.57 76.28,57.4 75.61,57.07 74.85,56.9 69.85,56.9 68.83,56.98 67.31,58.76 66.97,59.52 66.63,60.45 65.96,61.38 64.85,62.06 63.92,62.57 63.16,62.74 61.13,62.82 58.08,62.91 56.05,63.08 52.75,63.58 49.61,64.09 47.16,64.43 44.28,64.69 40.81,64.69 37.51,65.02 35.05,65.19 34.04,66.12 33.95,66.72 33.1,67.56 32.17,68.24 31.07,68.58 30.23,68.66 27.94,68.75 27.09,69.17 26.42,69.26 25.91,69.17
N$20
  pour Bottom (no thermals): 30.65,86.28 31.5,86.36 32.51,86.36 34.97,85.26 35.56,84.58 35.81,83.57 35.64,82.72 35.31,82.21 35.31,76.96 36.75,76.96 35.98,78.15 35.98,81.96 36.32,82.63 36.41,83.82 36.15,84.92 35.48,85.68 34.54,86.19 32.77,86.95 31.75,87.63 31.33,88.14 30.31,87.97
N$21
  pour Bottom (no thermals): 35.14,83.65 34.97,82.8 34.54,82.38 33.95,81.28 33.95,76.45 34.71,75.44 35.48,75.18 38.61,75.18 39.45,75.86 40.05,76.79 43.43,80.69 44.79,81.2 46.14,81.28 47.5,81.03 48.85,79.93 49.53,78.74 49.7,77.64 50.12,77.3 50.12,76.54 48.77,76.54 48.77,77.22 49.02,77.72 48.85,78.74 48.01,79.76 47.24,80.43 46.06,80.77 44.7,80.6 43.69,80.09 40.39,76.2 39.88,75.35 38.95,74.68 38.18,74.42 35.22,74.42 34.46,74.76 33.44,76.12 33.27,77.05 33.27,82.3 33.19,83.06 33.02,83.31 33.36,83.9
N$22
  pour Bottom (no thermals): 59.01,67.39 59.52,67.39 60.2,66.72 61.3,66.12 62.4,65.45 64.01,65.02 82.8,65.02 83.82,64.77 85.51,63.84 87.21,62.31 88.73,60.88 90.34,59.94 93.13,59.86 110.83,59.86 112.61,59.61 114.55,59.27 116.25,58.67 117.69,58 119.13,57.49 119.3,56.9 119.3,56.3 118.19,55.88 117.6,56.22 117.26,57.23 116.67,57.66 115.15,58.34 113.28,58.84 111.68,59.1 110.91,59.18 110.24,59.27 90.17,59.27 88.82,60.03 87.55,61.13 86.19,62.31 84.75,63.42 83.82,64.09 83.06,64.35 63.92,64.35 62.65,64.77 61.13,65.36 60.62,65.45 59.61,65.45 59.01,65.28
N$23
  pour Bottom (no thermals): 44.87,65.45 45.47,65.19 46.48,65.02 48.09,65.02 49.02,64.85 53.26,64.26 55.2,63.75 57.49,63.42 64.01,63.33 80.94,63.25 82.04,62.99 83.06,62.48 88.82,58.17 89.49,58.08 93.39,58 99.4,58 102.02,57.49 103.21,56.98 103.72,56.47 104.82,55.63 105.66,57.07 104.82,57.57 104.06,57.66 102.87,57.83 99.99,58.5 98.81,58.67 89.32,58.67 88.48,59.1 83.65,62.82 82.3,63.58 81.36,63.75 80.52,63.92 64.35,63.92 58.5,64.01 56.13,64.18 54.02,64.69 50.72,65.19 48.43,65.45 46.99,65.96 46.48,66.89 45.72,67.31
N$24
  pour Bottom (no thermals): 69.26,60.11 69.85,60.11 70.78,60.03 72.14,59.69 82.63,59.69 84.07,59.52 85.26,59.01 87.55,57.74 88.65,57.07 90.34,57.4 90.76,57.57 90.76,55.63 89.49,55.88 88.39,56.13 87.71,56.73 86.28,57.74 84.75,58.42 83.65,58.84 82.38,59.01 71.71,59.01 70.61,58.59 69.6,58.08 69.09,58.42
N$25
  pour Bottom (no thermals): 24.89,73.24 24.81,74.51 25.32,75.27 27.52,75.27 28.36,75.44 29.04,75.78 29.63,76.03 30.4,76.03 30.99,75.78 31.5,74.93 31.75,74.17 32.26,73.24 33.36,72.22 35.14,71.63 39.45,71.63 40.98,72.22 45.47,76.54 46.48,77.05 45.04,78.4 44.7,78.06 44.62,77.22 44.2,76.28 40.89,72.98 39.37,72.31 35.98,72.31 34.71,72.47 33.53,72.9 32.6,73.83 32.17,74.85 31.83,75.78 31.33,76.45 30.4,76.79 29.46,76.71 28.7,76.45 27.94,75.95 24.05,75.95 23.2,75.01 22.94,74.34 22.94,73.24
N$26
  pour Bottom (no thermals): 17.86,73.32 17.86,72.31 18.2,71.37 19.05,70.7 19.73,70.36 39.45,70.36 44.79,71.54 67.9,71.54 68.41,70.95 69.51,70.7 69.51,72.81 68.5,72.47 68.07,72.14 44.37,72.14 39.29,71.04 20.4,71.04 19.81,71.88 19.81,73.15
N$27
  pour Bottom (no thermals): 14.65,68.24 14.73,73.24 12.78,73.24 12.53,68.24
N$28
  pour Bottom (no thermals): 11.18,47.84 10.5,47.84 9.31,48.68 8.64,49.95 7.87,51.56 7.54,52.92 7.54,60.88 7.96,62.15 8.81,63.16 9.57,64.01 10.84,64.52 12.62,64.85 15.07,64.85 17.78,65.02 20.4,65.28 23.54,65.7 25.74,66.21 27.6,66.8 29.13,67.39 30.48,67.56 31.83,67.06 32.68,66.29 33.36,65.19 34.04,64.35 35.31,63.84 36.91,63.67 39.79,63.58 41.74,63.42 44.87,62.23 47.92,61.81 49.45,61.72 51.14,61.13 52.92,60.54 53.09,59.86 51.82,58.84 51.31,59.27 51.31,59.94 50.8,60.54 49.61,61.04 47.67,61.21 44.96,61.47 41.83,62.74 41.23,62.82 36.15,63.08 34.63,63.33 33.61,63.84 32.68,65.11 32.09,66.12 31.33,66.63 30.4,66.89 29.13,66.72 28.28,66.46 27.35,65.96 24.89,65.28 22.01,64.69 18.88,64.43 15.58,64.18 12.87,64.18 11.01,63.92 9.82,63.33 8.89,62.31 8.38,61.3 8.13,60.54 8.13,52.92 8.55,51.56 9.23,50.38 9.65,49.78 10.33,49.7 10.84,49.7
N$29
  pour Bottom (no thermals): 47.24,39.03 47.24,40.39 48.26,41.23 54.36,41.23 55.2,41.91 55.54,42.42 55.88,42.67 56.56,42.67 57.32,42.25 57.32,40.89 56.81,40.47 56.05,40.47 55.29,40.64 49.95,40.64 49.19,39.96 49.19,38.95
N$30
  pour Bottom (no thermals): 52.32,39.29 52.32,38.02 52.75,37.51 53.26,37.42 68.33,37.42 69.93,36.66 70.87,35.73 70.95,35.05 71.71,34.37 72.98,35.98 72.47,36.41 71.71,36.41 71.04,36.83 70.19,37.34 69.09,37.76 68.16,38.02 55.12,38.02 54.19,38.69 54.19,39.37
N$31
  pour Bottom (no thermals): 113.54,47.84 118.45,47.67 118.45,45.64 113.54,45.72
N$32
  pour Bottom (no thermals): 51.14,41.91 50.21,42.84 49.78,44.11 49.19,44.87 48.51,45.55 48.34,46.65 50.38,46.65 50.12,45.13 50.55,44.37 51.65,44.03 52.41,43.69 52.66,43.18
N$33
  pour Bottom (no thermals): 62.23,46.65 62.65,45.8 63.16,45.21 63.58,44.28 64.26,43.35 65.53,42.33 66.72,41.49 67.56,41.49 67.9,41.06 68.41,40.64 69,40.56 69,42.67 68.24,42.67 67.82,42.33 66.63,42.33 64.77,43.77 64.18,44.87 64.18,46.65
N$34
  pour Bottom (no thermals): 72.14,47.84 73.83,47.75 77.13,47.67 77.13,45.64 72.14,45.72
N$35
  pour Bottom (no thermals): 85.94,47.84 88.14,47.75 90.76,47.67 90.76,45.64 85.94,45.72
N$36
  pour Bottom (no thermals): 99.82,47.84 104.82,47.67 104.82,45.64 99.82,45.72
N$37
  pour Bottom (no thermals): 92.29,76.54 92.71,76.03 93.39,75.69 94.15,75.86 94.32,76.62 94.4,82.04 94.15,82.72 93.64,83.06 92.96,83.06 92.37,82.47 92.29,82.04
N$38
  pour Bottom (no thermals): 51.9,67.65 55.2,67.39 56.05,66.8 56.22,66.12 55.88,65.45 55.2,65.28 51.9,65.62
N$39
  pour Bottom (no thermals): 79.67,65.62 84.07,65.7 84.92,66.12 85.01,67.06 84.07,67.82 79.67,67.65
N$40
  pour Bottom (no thermals): 73.83,81.11 73.91,81.11 74.85,80.69 76.37,79.93 78.91,78.82 79.59,78.15 80.52,77.3 80.6,76.37 79.67,75.78 78.74,76.62 78.49,77.72 78.06,78.49 75.61,79.33 74.76,79.16 73.91,79.08
N$41
  pour Bottom (no thermals): 65.79,67.65 73.41,67.82 74.42,67.23 74.42,66.55 74.08,65.96 73.41,65.7 65.79,65.62
N$42
  pour Bottom (no thermals): 65.79,75.61 69.77,75.69 70.78,76.37 70.87,76.96 70.7,77.64 70.1,77.81 69.85,77.81 65.79,77.64
N$43
  pour Bottom (no thermals): 106.09,83.14 106.6,83.06 106.93,82.89 107.36,82.38 120.82,82.38 122.68,82.04 124.29,81.11 125.48,80.09 126.24,78.91 127.85,75.35 129.79,72.05 132.33,69.43 133.52,68.75 134.62,68.5 134.96,69 136.91,69 136.74,67.06 134.79,67.14 134.11,67.82 133.01,68.33 131.83,69 129.54,71.46 128.69,72.56 127.17,75.27 125.65,78.57 124.63,79.93 123.53,80.94 122.26,81.45 120.9,81.7 107.36,81.7 106.93,81.28 106.34,81.03 105.75,81.03
N$44
  pour Bottom (no thermals): 106.51,76.12 109.39,71.29 111.25,72.31 108.03,77.3
N$45
  pour Bottom (no thermals): 93.3,65.62 92.88,66.04 92.46,66.63 93.3,67.65 98.13,67.82 98.89,67.39 98.89,66.46 98.13,65.7
N$46
  pour Bottom (no thermals): 107.36,67.65 108.2,67.48 108.63,67.39 110.15,67.48 111.17,68.16 112.27,69.34 113.2,71.04 113.79,72.73 114.64,75.44 114.81,77.39 115.4,78.23 116.08,78.91 117.26,79.16 121.41,79.16 122.34,78.74 123.11,77.98 123.36,76.79 123.95,73.91 124.29,71.8 125.9,68.07 130.22,60.71 132.16,58.5 133.6,58.08 134.62,58.25 135.13,57.91 134.96,56.56 134.62,56.22 134.11,56.39 132.84,57.32 132,57.74 129.71,60.28 127.76,63.5 126.41,65.87 125.22,67.9 123.53,72.14 122.6,77.64 121.92,78.32 121.16,78.57 116.84,78.57 116.08,78.06 115.65,77.47 115.32,76.54 115.23,75.61 114.89,74.25 114.22,72.05 113.62,70.44 112.78,68.92 111.59,67.56 110.41,66.97 108.8,66.46 107.78,65.79 107.36,65.62
N$47
  pour Bottom (no thermals): 121.92,76.62 121.84,75.52 121.84,74.85 122.34,72.9 124.38,67.65 129.2,57.83 130.47,55.8 132.16,54.1 133.18,53.59 134.7,53.68 135.21,53.26 135.04,51.82 134.11,51.73 133.6,52.32 132.42,53.09 131.32,53.76 129.71,55.37 124.29,66.21 122.34,70.78 121.67,72.64 121.16,74.85 120.9,75.18 120.23,76.03 120.31,76.62
N$48
  pour Bottom (no thermals): 120.31,66.63 120.14,66.12 121.07,65.36 122,64.43 122.85,62.99 127.51,55.46 130.64,50.38 132.33,48.51 133.43,47.67 134.45,46.99 134.79,46.99 134.7,48.26 134.79,49.11 134.28,49.11 132.42,49.28 131.32,50.46 129.71,53 127.93,55.96 122.6,64.6 122.17,65.87 121.84,67.23
N$49
  pour Bottom (no thermals): 175.26,65.62 177.04,65.7 178.22,65.28 179.24,64.77 181.27,64.01 184.4,63.08 185.84,62.82 187.88,62.74 190.16,62.74 192.19,62.91 193.04,63.67 193.55,64.26 193.55,65.19 191.69,65.19 191.6,64.6 191.26,63.84 189.99,63.33 187.88,63.25 186.18,63.42 183.73,63.92 180.85,64.94 178.31,65.79 176.78,66.55 176.19,67.14 175.68,67.39 175.18,67.48
N$50
  pour Bottom (no thermals): 175.18,77.39 175.85,77.39 177.38,76.45 178.56,75.69 179.92,74.68 181.1,73.74 184.66,69.85 186.01,68.07 187.62,66.21 188.38,65.96 188.72,65.28 187.11,64.18 186.77,65.02 186.61,65.62 186.61,66.04 185.93,67.23 184.23,69.26 182.63,71.29 180.59,73.41 178.73,74.85 177.29,75.69 176.02,75.69 175.26,75.61
N$51
  pour Bottom (no thermals): 198.71,65.19 198.71,64.69 198.37,64.09 197.87,63.75 196,62.15 194.56,61.64 180.42,61.64 179.58,61.89 178.9,62.06 178.22,63.08 177.63,63.42 176.78,63.42 176.11,63.08 175.6,62.48 175.34,61.81 175.34,58.34 175.51,58 176.02,57.23 176.19,56.56 175.34,56.39 174.24,56.64 174.41,57.32 174.67,58.17 174.67,61.98 175.01,62.65 175.51,63.5 176.53,64.09 177.88,64.09 178.56,63.58 179.32,62.74 180.42,62.23 194.06,62.23 195.33,62.57 196.17,63.33 196.6,63.92 196.77,65.36
N$52
  pour Bottom (no thermals): 176.28,46.65 175.85,47.5 175.51,48.18 175.51,50.72 175.68,51.56 176.02,52.66 176.78,53.68 178.48,55.12 179.41,55.71 181.02,56.56 184.15,57.66 186.52,58.17 188.47,58.59 190.67,58.84 192.87,59.18 195.33,59.52 197.02,59.77 199.05,60.11 200.74,60.62 202.18,61.21 203.88,61.89 205.4,62.74 206.84,63.42 208.11,63.84 208.79,63.92 209.3,64.35 207.86,65.7 207.69,65.53 206.76,64.18 204.81,63.08 202.95,62.06 201.25,61.47 199.9,60.96 198.29,60.54 196.85,60.28 194.9,60.11 193.38,59.94 190.75,59.61 188.38,59.18 185.34,58.59 183.3,58 181.19,57.23 178.65,56.05 177.12,54.95 176.19,54.1 175.6,53.09 175.18,51.9 174.84,50.72 174.84,48.09 174.67,47.67 174.41,47.24 174.24,46.65
N$53  (via drill 0.81 pad 2.03)
  Top 0.813: v163.24,51.56 v177.12,51.56
  pour Bottom (no thermals): 162.56,46.65 164.34,51.48 162.31,52.07 160.53,46.65
  pour Bottom (no thermals): 176.19,51.31 176.45,52.07 176.7,52.58 177.72,53.34 179.41,54.44 180.68,55.29 182.2,55.96 183.47,56.39 185.25,57.07 187.28,57.49 189.4,57.91 191.85,58.25 194.23,58.59 196.34,58.84 197.95,59.27 199.73,59.77 201.59,60.28 203.2,60.88 205.91,61.89 209.8,63.75 210.82,64.35 211.33,64.85 211.92,65.7 213.19,64.26 212.43,63.84 210.74,63.42 208.79,62.57 207.09,61.81 204.89,60.79 202.86,60.2 200.74,59.44 198.37,58.84 196.43,58.34 192.02,57.66 189.74,57.32 187.45,56.9 185.08,56.39 183.3,55.71 181.36,55.03 180,54.19 179.15,53.26 178.48,52.49 178.22,51.56 177.97,51.05
N$54  (via drill 0.81 pad 2.03)
  Top 0.813: v163.24,61.72 v177.12,61.72
  pour Bottom (no thermals): 162.56,56.64 164.34,61.55 162.31,62.23 160.53,56.64
  pour Bottom (no thermals): 177.63,62.74 177.97,62.48 178.14,62.06 178.48,61.55 179.07,61.13 179.92,61.04 187.71,61.04 193.8,61.13 195.66,61.21 198.04,61.47 199.81,61.98 201.08,62.74 203.37,64.52 205.23,65.96 206.42,66.8 207.69,67.23 215.48,67.23 216.75,66.63 218.1,66.04 218.69,65.36 217.17,64.26 216.75,64.6 216.49,65.62 215.39,66.55 207.77,66.55 206.59,66.12 205.06,65.19 203.54,63.92 202.1,62.74 201,61.98 199.81,61.47 198.29,61.04 196.68,60.71 195.24,60.62 188.55,60.45 177.63,60.45 176.87,60.54 176.28,61.3
N$55
  pour Bottom (no thermals): 125.9,72.9 126.32,72.9 126.66,72.56 127,72.14 127,71.29 127.25,69.93 130.64,64.77 130.98,64.01 131.91,62.99 133.01,62.48 135.38,62.31 137.33,62.4 138.35,62.91 139.19,63.75 139.53,64.69 139.53,74 139.11,75.69 138.6,76.71 138.01,77.3 136.65,77.3 136.65,79.16 137.58,79.25 138.18,78.82 138.68,77.89 139.45,76.62 139.87,75.35 140.21,74 140.21,64.77 139.78,63.5 138.77,62.57 137.84,61.98 137.24,61.72 133.43,61.72 132.59,61.98 131.57,62.48 130.73,63.33 126.92,69.34 125.9,70.53 125.31,71.04 124.97,71.63 124.97,72.22
N$56
  pour Bottom (no thermals): 144.27,76.62 145.54,76.71 146.22,75.95 148.08,75.95 148.67,75.52 149.27,74.85 149.44,74.08 149.44,51.82 149.01,50.55 148.34,49.53 147.91,48.77 147.74,48.01 147.4,47.58 146.73,46.99 145.71,48.94 146.22,49.19 146.9,49.28 147.91,50.04 148.42,50.97 148.76,51.99 148.76,74.17 148.51,74.76 148,75.18 146.05,75.18 145.71,75.01 145.29,74.76 144.36,74.68
N$57
  pour Bottom (no thermals): 144.36,71.54 145.29,71.54 145.88,70.95 146.73,70.87 147.66,70.61 148.25,69.77 148.25,54.27 147.91,53.42 147.49,52.49 146.81,51.73 145.54,53.34 145.88,53.59 146.9,53.93 147.66,54.53 147.74,54.95 147.74,69.51 147.32,70.02 146.56,70.19 146.13,70.19 145.46,69.6 144.36,69.6
N$58
  pour Bottom (no thermals): 144.36,66.46 145.54,66.38 145.97,65.96 146.9,64.85 147.15,63.84 147.15,56.98 146.73,56.56 146.3,56.56 145.37,57.91 145.97,58.34 146.47,59.01 146.47,64.18 146.05,64.77 145.37,64.52 144.36,64.52
N$59